# Altium schematic sheet 1ff_adapter.SchDoc
size A4; Organization: Altium Limited; Address1: L3, 12a Rodborough Rd; Address2: Frenchs Forest; Address3: NSW; Address4: Australia 2086
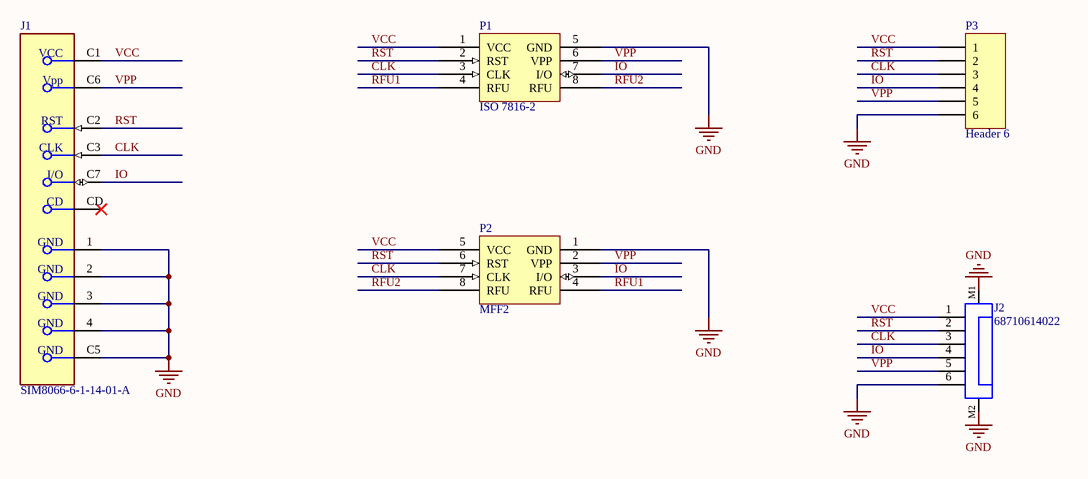
[diagram p0: 1ff_adapter.SchDoc]

## Parts
J1  SIM8066-6-1-14-01-A  [FP-SIM8066-6-1-14-01-A-MFG]
J2  68710614022  [68710614022]
P1  ISO 7816-2  [ISO 7816-2-Footprint-1]
P2  MFF2  [SON127P600-8N]
P3  Header 6  [HDR1X6]

## Nets
GND: J1.1(GND) J1.2(GND) J1.3(GND) J1.4(GND) J1.C5(GND) J2.6 J2.M1 J2.M2 P1.5(GND) P2.1(GND) P3.6
CLK: J1.C3(CLK) J2.3 P1.3(CLK) P2.7(CLK) P3.3
IO: J1.C7(I/O) J2.4 P1.7(I/O) P2.3(I/O) P3.4
RFU1: P1.4(RFU) P2.4(RFU)
RFU2: P1.8(RFU) P2.8(RFU)
RST: J1.C2(RST) J2.2 P1.2(RST) P2.6(RST) P3.2
VCC: J1.C1(VCC) J2.1 P1.1(VCC) P2.5(VCC) P3.1
VPP: J1.C6(Vpp) J2.5 P1.6(VPP) P2.2(VPP) P3.5

Not connected (* = marked no-connect by the designer): J1 CD*

## Notes on the sheet
- Title
- Size:
- Date:
- A4
- Number:
- Time:
- Revision:
- Sheet
- of
- File:

## Library data of the parts
J1 = CMP-03329-117635865-1: SIM8066-6-1-14-01-A Memory Card Connectors 1.44mm Nano SIM Conn w/Peg and Switch; Current Rating: 1A; Number of Contacts: 6; Voltage Rating: 30V; NexarPartId: 117635865; Number of Pins: 6; Min Operating Temperature: -40°C; Max Operating Temperature: 85°C; Contact Material: Gold, Nickel
J2 = CMP-1502-01549-2: NexarPartId: 8917696; Gender: Male; Operating Supply Voltage: 50V; Actuator Material: Liquid Crystal Polymer, Polymer; Number of Contacts: 6; Contact Resistance: 20mΩ; Pitch: 500µm; Contact Location: Top; Current Rating: 500mA; Insulation Resistance: 100MΩ; Mount: Surface Mount; Number of Rows: 1; Min Operating Temperature: -25°C; Flammability Rating: UL94 V-0; Packaging: Tape and Reel; Width: 2.1mm; REACH SVHC: Unknown; Number of Pins: 6; Housing Material: Liquid Crystal Polymer; Length: 3.6mm; RoHS: Compliant; Orientation: Horizontal; Height: 2.25mm; Lead Pitch: 500µm; Contact Plating: Tin; Voltage Rating: 50V; Max Operating Temperature: 85°C; Termination: SMD/SMT; Number of Positions: 6; Contact Material: Tin
P1 = CMP-00007-2
P2 = CMP-00008-1: ETSI TS 102 671 V18.0.0 (2022-11) MFF2
P3 = Header 6: Header, 6-Pin; LatestRevisionDate: 17-Jul-2002; LatestRevisionNote: Re-released for DXP Platform.; Publisher: Altium Limited